# EAGLE design LAUNCHXL-F28069_B_1400922 (EAGLE 8.4.1)

## Sheet 1 of 2
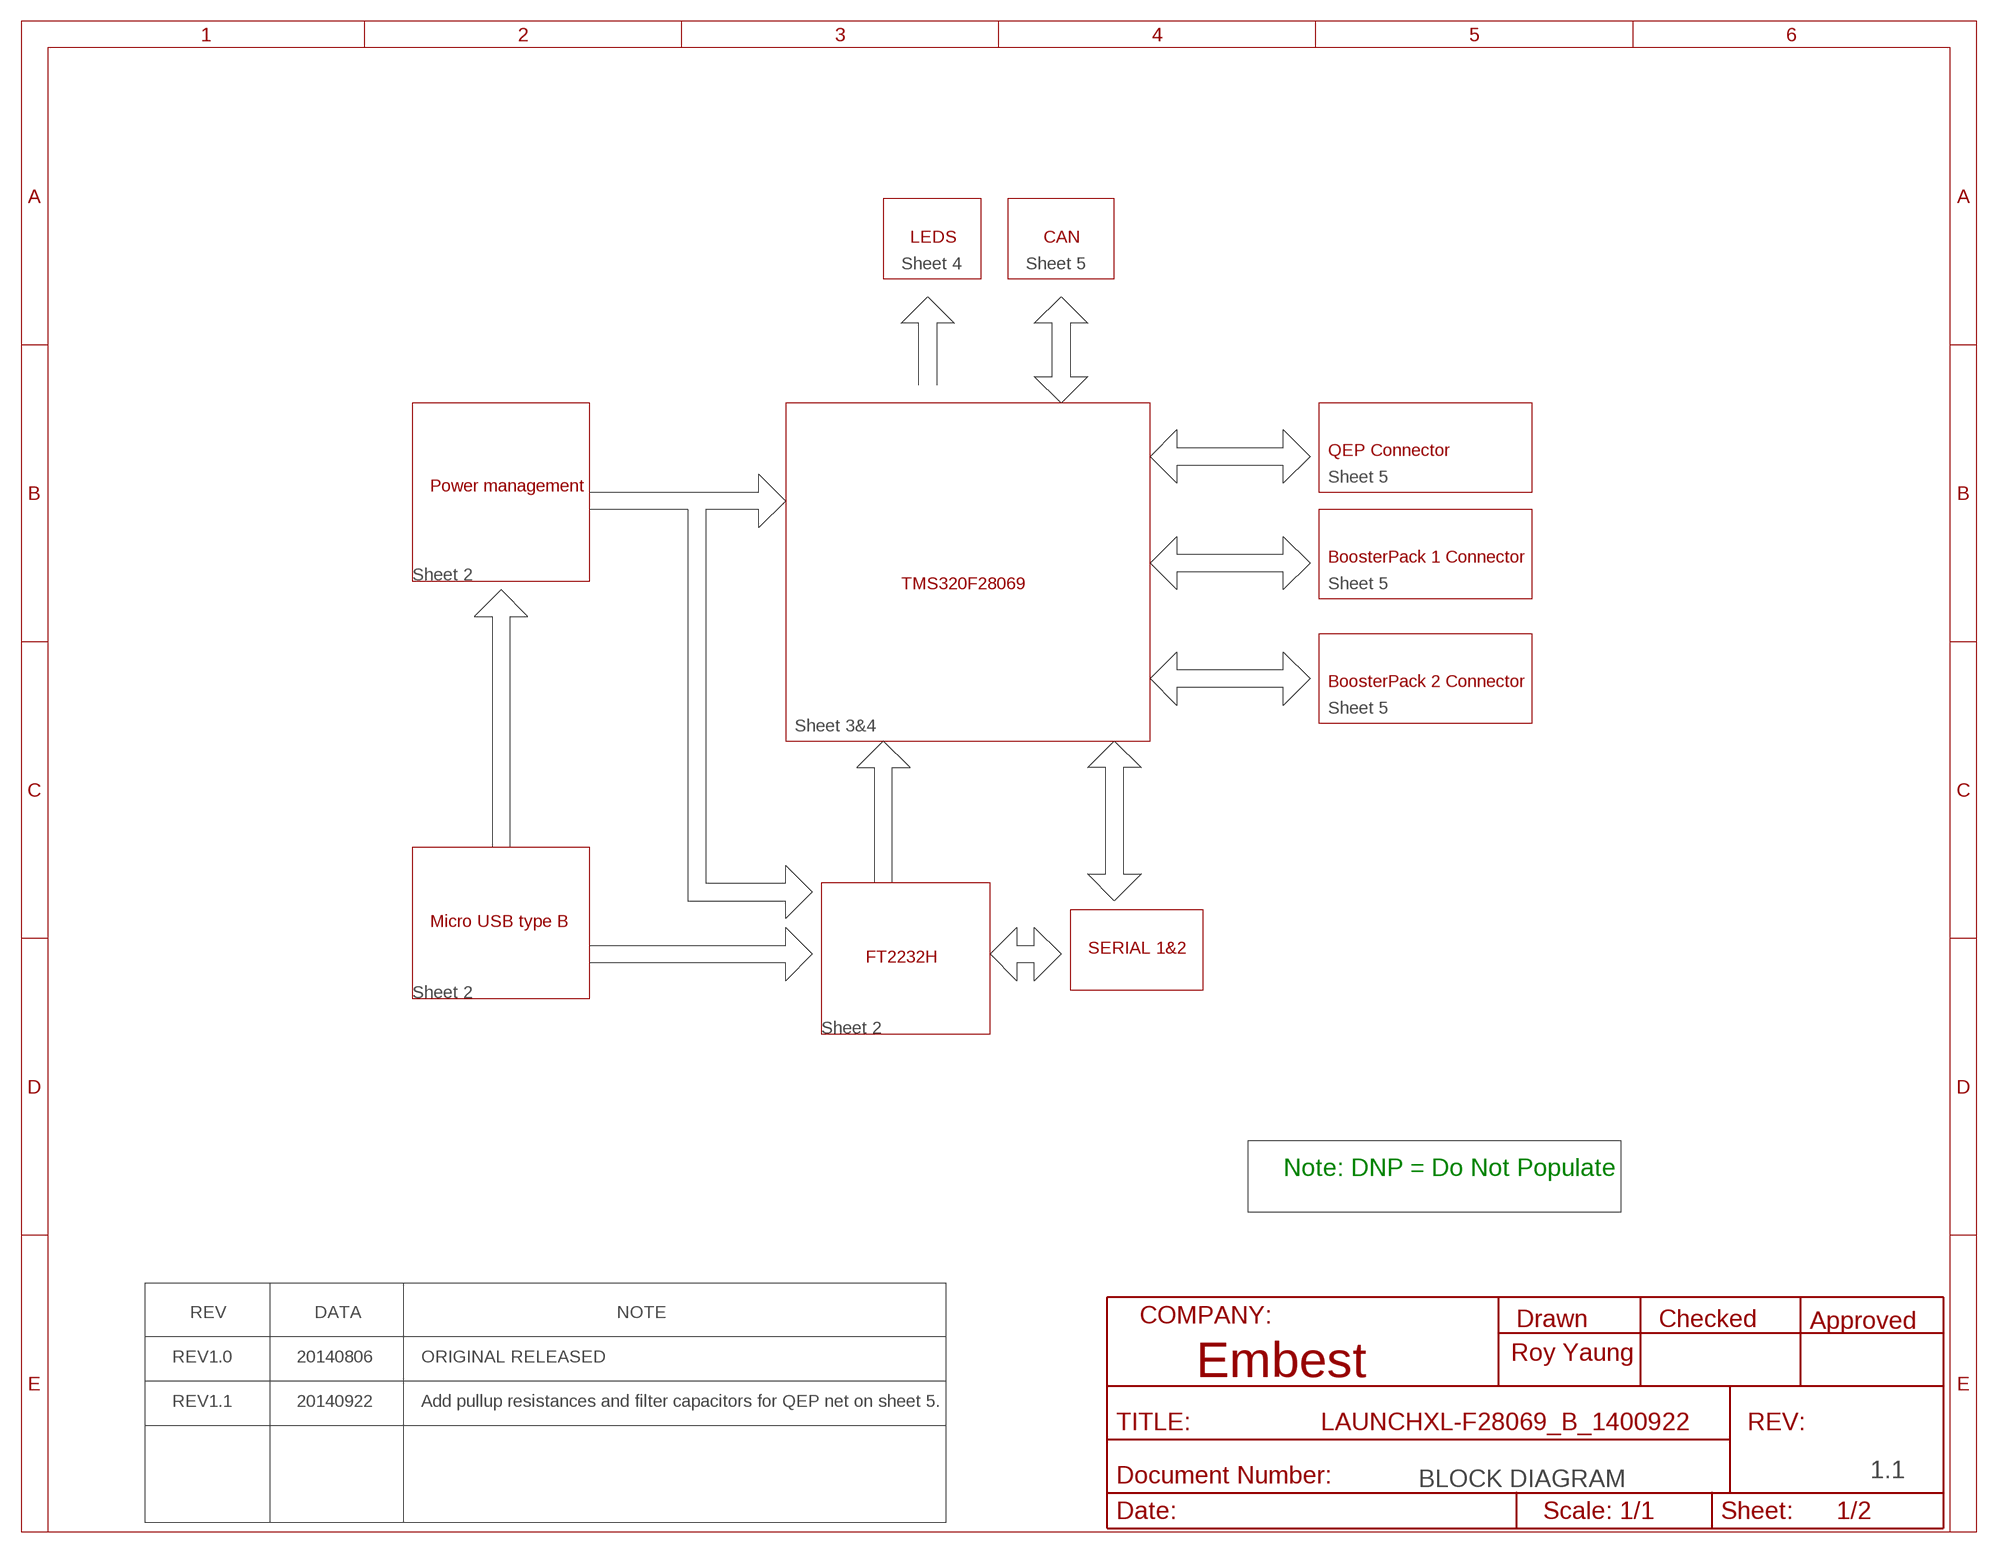
[diagram p0: schematic, sheet 1]

### Notes on the sheet
- LEDS | CAN
- Sheet 4 | Sheet 5
- QEP Connector
- Sheet 5
- Power management
- BoosterPack 1 Connector
- Sheet 2
- TMS320F28069 | Sheet 5
- BoosterPack 2 Connector
- Sheet 5
- Sheet 3&4
- Micro USB type B
- SERIAL 1&2
- FT2232H
- Sheet 2
- Sheet 2
- Note: DNP = Do Not Populate
- REV | DATA | NOTE
- REV1.0 | 20140806 | ORIGINAL RELEASED | Roy Yaung
- REV1.1 | 20140922 | Add pullup resistances and filter capacitors for QEP net on sheet 5.
- 1.1
- BLOCK DIAGRAM

## Sheet 2 of 2
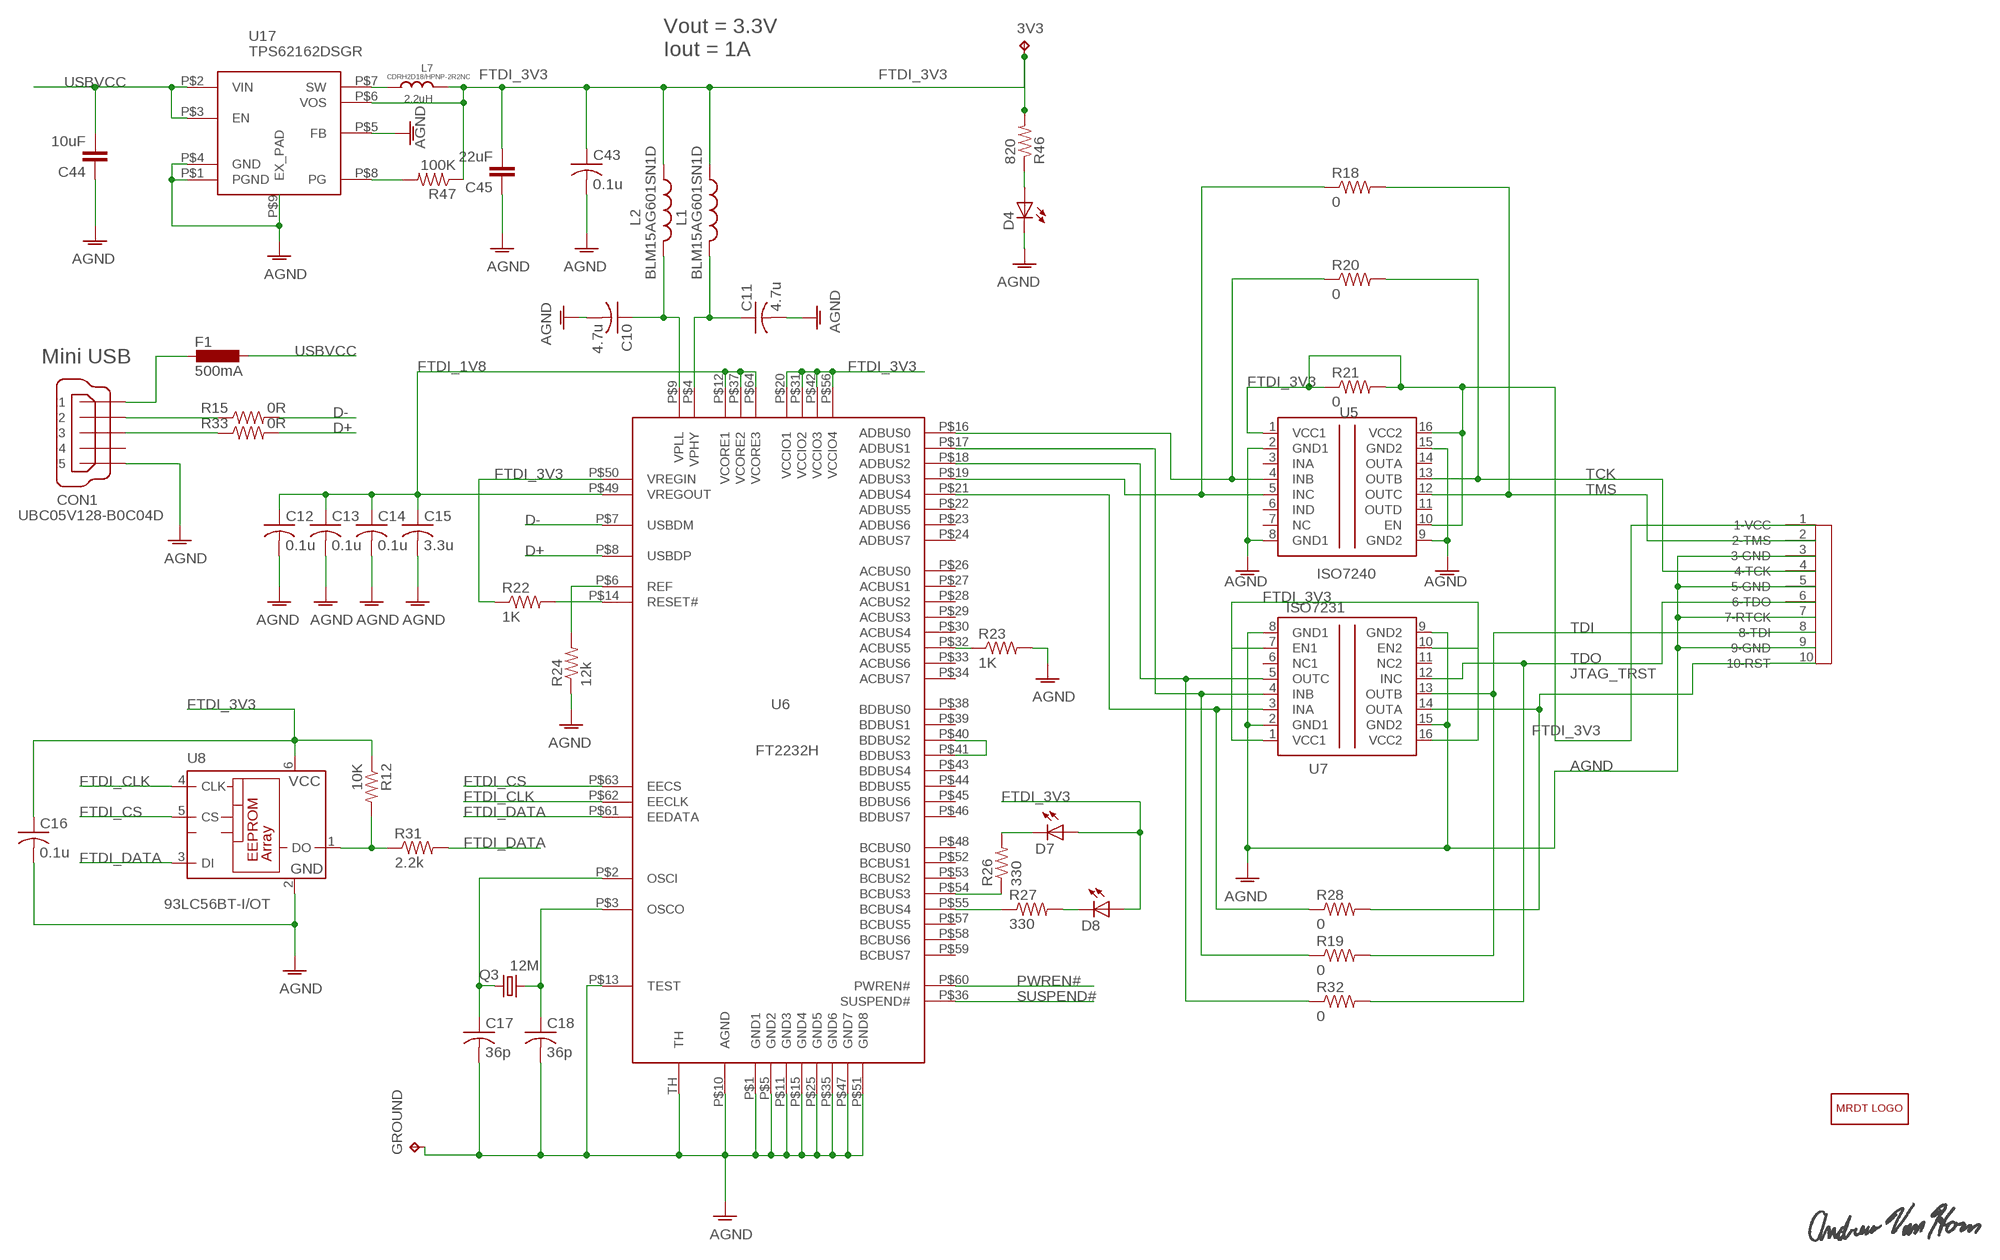
[diagram p1: schematic, sheet 2]

### Parts
3V3  TESTPAD_TPB1,27  [TESTPAD_B1,27]
C10  4.7u  C-USC0402  [C0402]
C11  4.7u  C-USC0402  [C0402]
C12  0.1u  C-USC0402  [C0402]
C13  0.1u  C-USC0402  [C0402]
C14  0.1u  C-USC0402  [C0402]
C15  3.3u  C-USC0402  [C0402]
C16  0.1u  C-USC0402  [C0402]
C17  36p  C-USC0402  [C0402]
C18  36p  C-USC0402  [C0402]
C43  0.1u  C-USC0402  [C0402]
C44  10uF  SPARKFUN_CAP1210  [SPARKFUN_1210]
C45  22uF  SPARKFUN_CAP1210  [SPARKFUN_1210]
CON1  UBC05V128-B0C04D  MINI-USB-32005-201  [32005-201]
D4  LEDCHIP-LED0603  [CHIP-LED0603]
D7  LEDCHIP-LED0603  [CHIP-LED0603]
D8  LEDCHIP-LED0603  [CHIP-LED0603]
F1  500mA  L-EUL1812  [L1812]
GROUND  TESTPAD_TPB1,27  [TESTPAD_B1,27]
L1  BLM15AG601SN1D  L-US0402  [R0402]
L2  BLM15AG601SN1D  L-US0402  [R0402]
L7  2.2uH  VLF4012A`  [INDUCT-3.2*3.2]
LOGO1  MRDT_LOGO  [MRDT_LOGO]
Q3  12M  CRYSTALHC49UP  [HC49UP]
R12  10K  R-US_R0402  [R0402]
R15  0R  R-US_R0402  [R0402]
R18  0  R-US_R1206  [R1206]
R19  0  R-US_R1206  [R1206]
R20  0  R-US_R1206  [R1206]
R21  0  R-US_R1206  [R1206]
R22  1K  R-US_R0402  [R0402]
R23  1K  R-US_R0402  [R0402]
R24  12k  R-US_R0402  [R0402]
R26  330  R-US_R0402  [R0402]
R27  330  R-US_R0402  [R0402]
R28  0  R-US_R1206  [R1206]
R31  2.2k  R-US_R0402  [R0402]
R32  0  R-US_R1206  [R1206]
R33  0R  R-US_R0402  [R0402]
R46  820  R-US_R0402  [R0402]
R47  100K  R-US_R0402  [R0402]
U5  ISO7240  [SO-16DW]
U6  FT2232H  [QFN64]
U7  ISO7231  [SO-16DW]
U8  93LC56BT-I/OT  93  [SOT23-6]
U17  TPS62162DSGR  [TI_DSG8]
U$1  1175-1733-ND  [1.27MM_2X5_BOX_HEADER_STRAIGHT]
U$2  ANDREW_VAN_HORN_SIGNATURE  [ANDREW_VAN_HORN_SIGNATURE]

### Nets
AGND: C10.2 C11.2 C12.2 C13.2 C14.2 C15.2 C16.2 C17.2 C18.2 C43.2 C44.1 C45.1 CON1.5 D4.C GROUND.TP R23.2 R24.1 U5.2(GND1) U5.8(GND1) U5.9(GND2) U5.15(GND2) U6.P$1(GND1) U6.P$5(GND2) U6.P$10(AGND) U6.P$11(GND3) U6.P$13(TEST) U6.P$15(GND4) U6.P$25(GND5) U6.P$35(GND6) U6.P$47(GND7) U6.P$51(GND8) U6.TH U7.2(GND1) U7.8(GND1) U7.9(GND2) U7.15(GND2) U8.2(GND) U17.P$1(PGND) U17.P$4(GND) U17.P$5(FB) U17.P$9(EX_PAD) U$1.3(3-GND) U$1.5(5-GND) U$1.7(7-RTCK) U$1.9(9-GND)
D+: R33.2 U6.P$8(USBDP)
D-: R15.2 U6.P$7(USBDM)
FTDI_1V8: C12.1 C13.1 C14.1 C15.1 U6.P$12(VCORE1) U6.P$37(VCORE2) U6.P$49(VREGOUT) U6.P$64(VCORE3)
FTDI_3V3: 3V3.TP C16.1 C43.1 C45.2 D7.A D8.A L1.1 L2.1 L7.P$1 R12.1 R21.1 R21.2 R22.1 R46.2 R47.1 U5.1(VCC1) U5.10(EN) U5.16(VCC2) U6.P$20(VCCIO1) U6.P$31(VCCIO2) U6.P$42(VCCIO3) U6.P$50(VREGIN) U6.P$56(VCCIO4) U7.1(VCC1) U7.7(EN1) U7.10(EN2) U7.16(VCC2) U8.6(VCC) U17.P$6(VOS) U$1.1(1-VCC)
FTDI_CLK: U6.P$62(EECLK) U8.4(CLK)
FTDI_CS: U6.P$63(EECS) U8.5(CS)
FTDI_DATA: R31.2 U6.P$61(EEDATA) U8.3(DI)
JTAG_TRST: R28.2 U7.14(OUTA) U$1.10(10-RST)
N$1: R20.1 U5.4(INB) U6.P$16(ADBUS0)
N$2: C17.1 Q3.1 U6.P$2(OSCI)
N$4: R19.1 U6.P$17(ADBUS1) U7.4(INB)
N$5: R32.1 U6.P$18(ADBUS2) U7.5(OUTC)
N$6: R18.1 U5.5(INC) U6.P$19(ADBUS3)
N$7: C18.1 Q3.2 U6.P$3(OSCO)
N$12: R12.2 R31.1 U8.1(DO)
N$13: R28.1 U6.P$21(ADBUS4) U7.3(INA)
N$14: R23.1 U6.P$32(ACBUS5)
N$15: U6.P$40(BDBUS2) U6.P$41(BDBUS3)
N$17: R24.2 U6.P$6(REF)
N$19: R26.1 U6.P$54(BCBUS3)
N$20: C11.1 L1.2 U6.P$4(VPHY)
N$22: R27.1 U6.P$55(BCBUS4)
N$23: D7.C R26.2
N$24: D8.C R27.2
N$26: C10.1 L2.2 U6.P$9(VPLL)
N$34: R22.2 U6.P$14(RESET#)
N$38: CON1.2 R15.1
N$39: CON1.3 R33.1
N$40: D4.A R46.1
N$43: R47.2 U17.P$8(PG)
N$51: L7.P$2 U17.P$7(SW)
PWREN#: U6.P$60(PWREN#)
SUSPEND#: U6.P$36(SUSPEND#)
TCK: R20.2 U5.13(OUTB) U$1.4(4-TCK)
TDI: R19.2 U7.13(OUTB) U$1.8(8-TDI)
TDO: R32.2 U7.12(INC) U$1.6(6-TDO)
TMS: R18.2 U5.12(OUTC) U$1.2(2-TMS)
USBVCC: C44.2 F1.1 U17.P$2(VIN) U17.P$3(EN)
XUSB: CON1.1 F1.2
Unconnected: CON1.4 U5.3(INA) U5.6(IND) U5.7(NC) U5.11(OUTD) U5.14(OUTA) U6.P$22(ADBUS5) U6.P$23(ADBUS6) U6.P$24(ADBUS7) U6.P$26(ACBUS0) U6.P$27(ACBUS1) U6.P$28(ACBUS2) U6.P$29(ACBUS3) U6.P$30(ACBUS4) U6.P$33(ACBUS6) U6.P$34(ACBUS7) U6.P$38(BDBUS0) U6.P$39(BDBUS1) U6.P$43(BDBUS4) U6.P$44(BDBUS5) U6.P$45(BDBUS6) U6.P$46(BDBUS7) U6.P$48(BCBUS0) U6.P$52(BCBUS1) U6.P$53(BCBUS2) U6.P$57(BCBUS5) U6.P$58(BCBUS6) U6.P$59(BCBUS7) U7.6(NC1) U7.11(NC2)

### Notes on the sheet
- Vout = 3.3V
- Iout = 1A
- CDRH2D18/HPNP-2R2NC
- Mini USB

## Library data of the parts
3V3 GROUND = RF430FRL152H_EVM_a:TESTPAD_TP: Test pad
C10-C18 C43 = rcl:C-US: CAPACITOR, American symbol
C44 C45 = RF430FRL152H_EVM_a:SPARKFUN_CAP: Capacitor Standard 0603 ceramic capacitor, and 0.1" leaded capacitor.
CON1 = con-cypressindustries:MINI-USB-: MINI USB-B Conector Source: www.cypressindustries.com; OC_FARNELL: unknown; OC_NEWARK: unknown
D4 D7 D8 = led:LED: LED OSRAM: - CHIPLED LG R971, LG N971, LY N971, LG Q971, LY Q971, LO R971, LY R971 LH N974, LH R974 LS Q976, LO Q976, LY Q976 LO Q996 - Hyper CHIPLED LW Q18S LB Q993, LB Q99A, LB R99A - SideLED LS A670, LO A670, LY A670, LG A670, LP A670 LB A673, LV A673, LT A673, LW A673 LH A674 LY A675 LS A676, LA A676, LO A676, LY A676, LW A676 LS A679, LY A679, LG A679 - Hyper Micro SIDELED® LS Y876, LA Y876, LO Y876, LY Y876 LT Y87S - SmartLED LW L88C, LW L88S LB L89C, LB L89S, LG L890 LS L89K, LO L89K, LY L89K LS L896, LA L896, LO L896, LY L896 - TOPLED LS T670, LO T670, LY T670, LG T670, LP T670 LSG T670, LSP T670, LSY T670, LOP T670, LYG T670 LG T671, LOG T671, LSG T671 LB T673, LV T673, LT T673, LW T673 LH T674 LS T676, LA T676, LO T676, LY T676, LB T676, LH T676, LSB T676, LW T676 LB T67C, LV T67C, LT T67C, LS T67K, LO T67K, LY T67K, LW E67C LS E67B, LA E67B, LO E67B, LY E67B, LB E67C, LV E67C, LT E67C LW T67C LS T679, LY T679, LG T679 LS T770, LO T770, LY T770, LG T770, LP T770 LB T773, LV T773, LT T773, LW T773 LH T774 LS E675, LA E675, LY E675, LS T675 LS T776, LA T776, LO T776, LY T776, LB T776 LHGB T686 LT T68C, LB T68C - Hyper Mini TOPLED® LB M676 - Mini TOPLED Santana® LG M470 LS M47K, LO M47K, LY M47K Source: http://www.osram.convergy.de LUXEON: - LUMILED® LXK2-PW12-R00, LXK2-PW12-S00, LXK2-PW14-U00, LXK2-PW14-V00 LXK2-PM12-R00, LXK2-PM12-S00, LXK2-PM14-U00 LXK2-PE12-Q00, LXK2-PE12-R00, LXK2-PE12-S00, LXK2-PE14-T00, LXK2-PE14-U00 LXK2-PB12-K00, LXK2-PB12-L00, LXK2-PB12-M00, LXK2-PB14-N00, LXK2-PB14-P00, LXK2-PB14-Q00 LXK2-PR12-L00, LXK2-PR12-M00, LXK2-PR14-Q00, LXK2-PR14-R00 LXK2-PD12-Q00, LXK2-PD12-R00, LXK2-PD12-S00 LXK2-PH12-R00, LXK2-PH12-S00 LXK2-PL12-P00, LXK2-PL12-Q00, LXK2-PL12-R00 Source: www.luxeon.com KINGBRIGHT: KA-3528ASYC Source: www.kingbright.com
F1 = rcl:L-EU: INDUCTOR, European symbol
L1 L2 = rcl:L-US: INDUCTOR, American symbol
L7 = LAUNCHXL-F28027:VLF4012A
LOGO1 = MRDT-Hardware:MRDT_LOGO
Q3 = crystal:CRYSTAL: CRYSTAL; OC_FARNELL: unknown; OC_NEWARK: unknown
R12 R15 R18-R24 R26-R28 R31-R33 R46 R47 = rcl:R-US_: RESISTOR, American symbol
U5 = texas:ISO7240: HIGH SPEED QUAD DIGITAL ISOLATORS Source: http://focus.ti.com/lit/ds/symlink/iso7240m.pdf; MPN: ISO7240MDW; OC_FARNELL: 1755124; OC_NEWARK: 58M0385
U6 = ti_trey:FT2232H
U7 = texas:ISO7231
U8 = ti_trey:93*: Serial EPROM 1 K/2 K/4 K, low voltage, Microwire
U17 = LAUNCHXL-F28027:TPS62162DSGR
U$1 = MRDT-Connectors:1175-1733-ND
U$2 = MRDT-Signatures:ANDREW_VAN_HORN_SIGNATURE

## Net classes
0 default: width 0.152 mm, drill 0.305 mm, clearance 0.152 mm

## Board
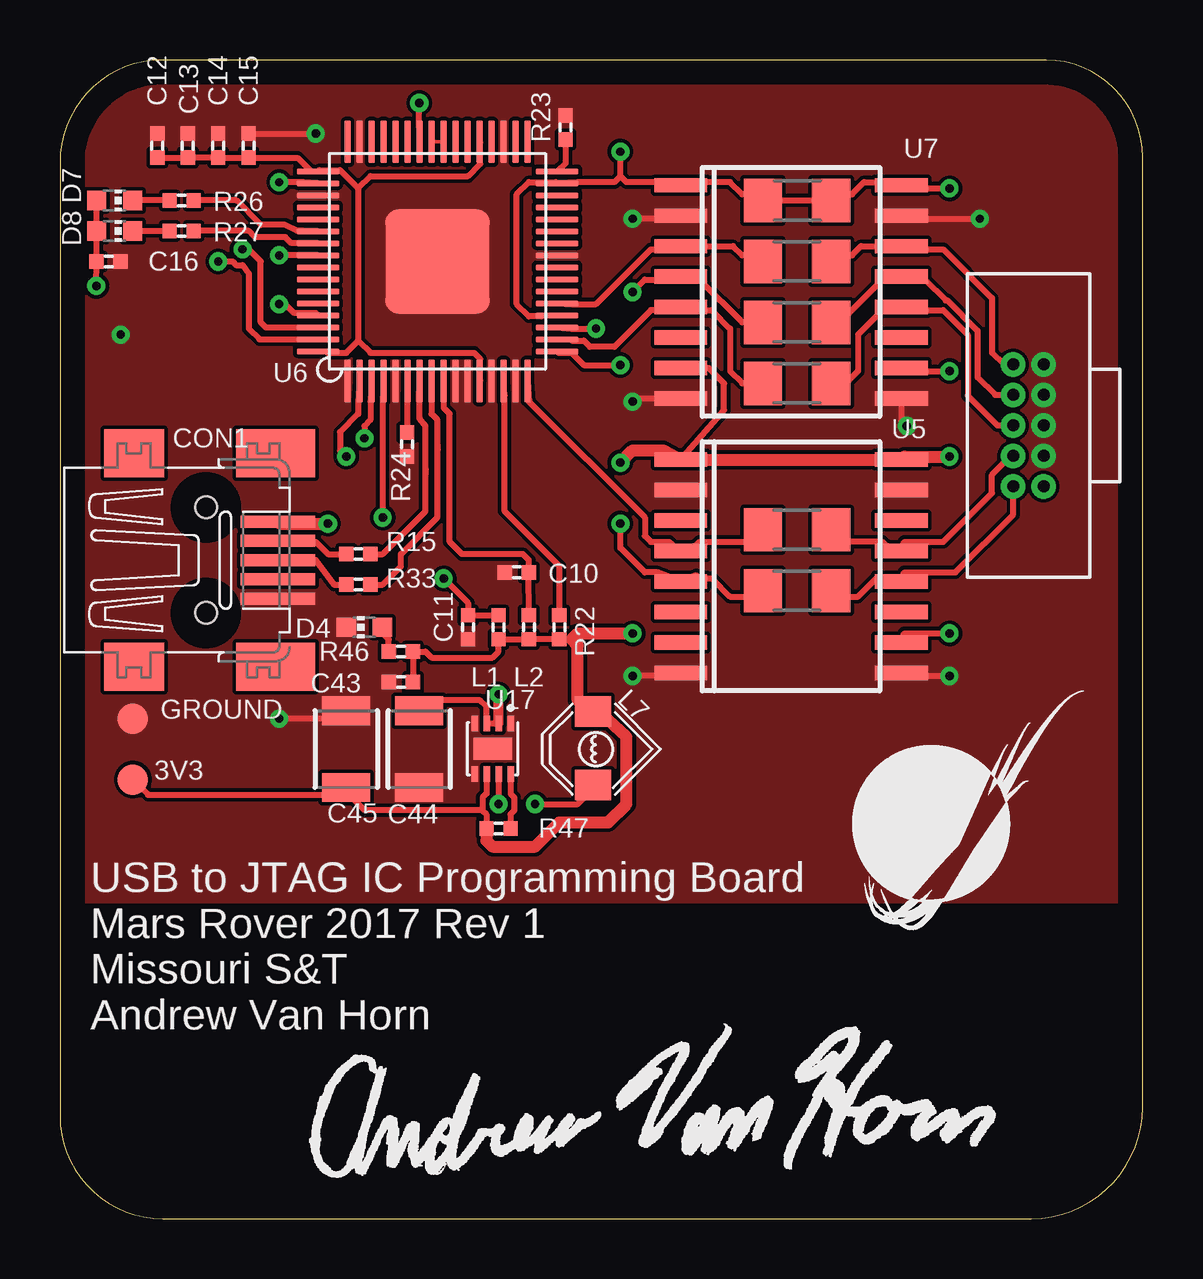
[diagram p2: board, top side]
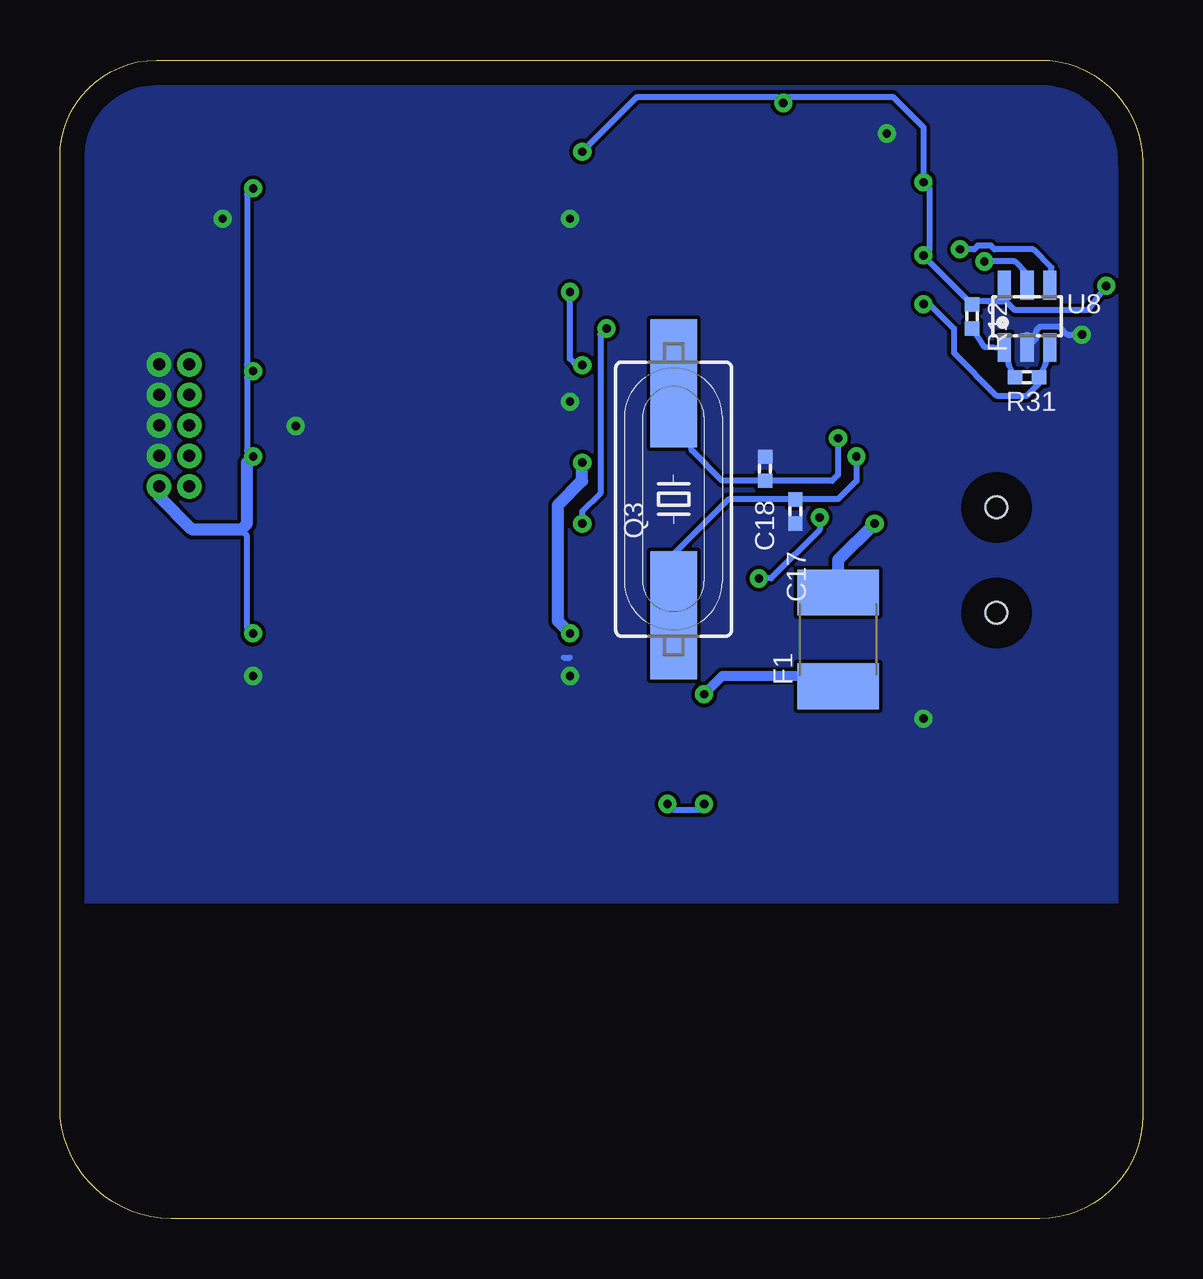
[diagram p3: board, bottom side, seen from below]

Size 45.13 x 48.27 mm. Coordinates in mm from the lower left corner, seen from the top.
Outline: 0,43.99 0,4.29 arc90 4.29,0 40.49,0 arc90 45.13,4.64 45.13,44.23 arc90 41.11,48.27 4.27,48.27 arc90 0,43.99
Copper layers (1*16): Top 0.035mm / dielectric 1.5mm / Bottom 0.035mm
Design rules "default": minimum track width 6mil, minimum drill 0.35mm, track to track 6mil, track to pad 6mil, pad to pad 6mil, via to via 6mil, smd to smd 6mil, copper to edge 40mil, drill to drill 6mil, minimum pad ring 10mil, minimum via ring 8mil, stop-mask expansion 4mil, vias tented up to drill 0mil, thermal gap 10mil

### Footprints (pad centres in the part's own frame; a part is rotated, then mirrored left to right if it is on the bottom)
TESTPAD_B1,27 = smd 1.27 x 1.27: TP 0,0
C0402 = smd 0.6 x 0.6: 1 -0.5,0; 2 0.5,0
SPARKFUN_1210 = smd 1.2 x 2: 1 -1.6,0; 2 1.6,0
32005-201 = smd 3.1 x 0.5: 1 3,1.6; 2 3,0.8; 3 3,0; 4 3,-0.8; 5 3,-1.6 | smd 2.5 x 2: M1 -3,-4.45; M2 -3,4.45 | smd 3.3 x 2: M3 2.9,4.45; M4 2.9,-4.45 | hole 0.9: 0,2.2; 0,-2.2
CHIP-LED0603 = smd 0.8 x 0.8: A 0,-0.75; C 0,0.75
L1812 = smd 1.9 x 3.4: 1 -1.95,0; 2 1.95,0
R0402 = smd 0.6 x 0.6: 1 -0.5,0; 2 0.5,0
INDUCT-3.2*3.2 = smd 1.5 x 1.27 rotated 135: P$1 1.019,1.189 | smd 1.5 x 1.27 rotated 315: P$2 -1.137,-0.966
HC49UP = smd 5.334 x 1.93: 1 -4.826,0; 2 4.826,0
R1206 = smd 1.6 x 1.803: 1 -1.422,0; 2 1.422,0
SO-16DW = smd 0.6 x 2.2: 1 -4.445,-4.6; 2 -3.175,-4.6; 3 -1.905,-4.6; 4 -0.635,-4.6; 5 0.635,-4.6; 6 1.905,-4.6; 7 3.175,-4.6; 8 4.445,-4.6; 9 4.445,4.6; 10 3.175,4.6; 11 1.905,4.6; 12 0.635,4.6; 13 -0.635,4.6; 14 -1.905,4.6; 15 -3.175,4.6; 16 -4.445,4.6
QFN64 = smd 1.778 x 0.254: P$1 -4.983,3.75; P$2 -4.983,3.25; P$3 -4.983,2.75; P$4 -4.983,2.25; P$5 -4.983,1.75; P$6 -4.983,1.25; P$7 -4.983,0.75; P$8 -4.983,0.25; P$9 -4.983,-0.25; P$10 -4.983,-0.75; P$11 -4.983,-1.25; P$12 -4.983,-1.75; P$13 -4.983,-2.25; P$14 -4.983,-2.75; P$15 -4.983,-3.25; P$16 -4.983,-3.75; P$33 4.983,-3.75; P$34 4.983,-3.25; P$35 4.983,-2.75; P$36 4.983,-2.25; P$37 4.983,-1.75; P$38 4.983,-1.25; P$39 4.983,-0.75; P$40 4.983,-0.25; P$41 4.983,0.25; P$42 4.983,0.75; P$43 4.983,1.25; P$44 4.983,1.75; P$45 4.983,2.25; P$46 4.983,2.75; P$47 4.983,3.25; P$48 4.983,3.75 | smd 0.254 x 1.778: P$17 -3.75,-4.983; P$18 -3.25,-4.983; P$19 -2.75,-4.983; P$20 -2.25,-4.983; P$21 -1.75,-4.983; P$22 -1.25,-4.983; P$23 -0.75,-4.983; P$24 -0.25,-4.983; P$25 0.25,-4.983; P$26 0.75,-4.983; P$27 1.25,-4.983; P$28 1.75,-4.983; P$29 2.25,-4.983; P$30 2.75,-4.983; P$31 3.25,-4.983; P$32 3.75,-4.983; P$49 3.75,4.983; P$50 3.25,4.983; P$51 2.75,4.983; P$52 2.25,4.983; P$53 1.75,4.983; P$54 1.25,4.983; P$55 0.75,4.983; P$56 0.25,4.983; P$57 -0.25,4.983; P$58 -0.75,4.983; P$59 -1.25,4.983; P$60 -1.75,4.983; P$61 -2.25,4.983; P$62 -2.75,4.983; P$63 -3.25,4.983; P$64 -3.75,4.983 | smd 4.35 x 4.35: TH 0,0
SOT23-6 = smd 0.55 x 1.2: 1 -0.95,-1.3; 2 0,-1.3; 3 0.95,-1.3; 4 0.95,1.3; 5 0,1.3; 6 -0.95,1.3
TI_DSG8 = smd 0.27 x 0.635: P$1 0,-0.05; P$2 0.5,-0.05; P$3 1,-0.05; P$4 1.5,-0.05; P$5 1.5,2.05; P$6 1,2.05; P$7 0.5,2.05; P$8 0,2.05 | smd 1.6 x 0.9: P$9 0.75,1
1.27MM_2X5_BOX_HEADER_STRAIGHT = drill 0.5: 1 1.915,8.865; 2 3.185,8.865; 3 1.915,7.595; 4 3.185,7.595; 5 1.915,6.325; 6 3.185,6.325; 7 1.915,5.055; 8 3.185,5.055; 9 1.915,3.785; 10 3.185,3.785

### Placement (x,y rotation side)
3V3  3.04,18.29 0 top
C10  19.04,26.92 180 top
C11  17.01,24.64 270 top
C12  4.06,44.7 90 top
C13  5.33,44.7 90 top
C14  6.6,44.7 90 top
C15  7.87,44.7 90 top
C16  2.02,39.88 0 top
C17  14.47,29.46 270 bottom
C18  15.74,31.24 90 bottom
C43  14.22,22.35 180 top
C44  14.98,19.56 90 top
C45  11.93,19.56 270 top
CON1  6.09,27.43 0 top
D4  12.69,24.64 90 top
D7  2.28,42.42 270 top
D8  2.28,41.15 270 top
F1  12.69,24.13 90 bottom
GROUND  3.04,20.83 0 top
L1  18.28,24.64 90 top
L2  19.55,24.64 90 top
L7  22.34,19.56 45 top
LOGO1  33.01,11.18 0 top
Q3  19.55,29.97 90 bottom
R12  7.1,37.59 270 bottom
R15  12.44,27.69 0 top
R18  30.73,26.16 0 top
R19  30.73,37.34 0 top
R20  30.73,28.7 0 top
R21  30.73,42.42 180 top
R22  20.82,24.64 90 top
R23  21.07,45.47 90 top
R24  14.47,32.26 90 top
R26  5.07,42.42 180 top
R27  5.07,41.15 180 top
R28  30.73,39.88 0 top
R31  4.82,35.05 0 bottom
R32  30.73,34.8 0 top
R33  12.44,26.42 0 top
R46  14.22,23.62 0 top
R47  18.28,16.26 0 top
U5  30.47,27.18 270 top
U6  15.74,39.88 90 top
U7  30.47,38.61 270 top
U8  4.82,37.59 0 bottom
U17  18.79,20.57 180 top
U$1  42.92,39.37 180 top
U$2  9.14,0.76 0 top

### Tracks (layer width: path | path; a pad name or v marks a point on that pad's centre or on a via)
AGND  (via drill 0.35)
  Top 0.254: D4.C 11.93,24.63 | C15.2 v10.65,45.2 v10.66,45.21 | U7.8 23.99,34.16 v23.87,34.04 | U7.2 25.74,41.66 v23.87,41.66 | U7.15 35.2,41.66 v38.35,41.66 | U7.9 35.07,33.25 v35.3,33.02 | U5.9 35.2,22.61 v37.08,22.61 | U5.8 25.74,22.61 v23.87,22.61 | C45.1 11.6,20.83 v9.14,20.83
  Bottom 0.254: 4.82,36.83 U8.2 4.42,36.69 4.42,37.01 4.26,37.17 3.48,37.17 3.14,36.83 v2.53,36.83 | 24.12,23.37 23.87,23.37
  pour Top (no thermals): 1.01,47.75 44.44,47.75 44.44,13.21 0.25,13.21 0.25,46.74
  pour Bottom (no thermals): 0.75,47.5 44.7,47.5 44.7,14.99 44.95,13.21 0.5,13.21 0.5,46.99 0.75,47.24
D+
  Top 0.254: R33.2 13.45,26.42 14.22,27.18 14.22,27.69 15.74,29.21 15.74,32.26 | U6.P$8 15.49,34.04 15.49,33.53 15.74,33.27 15.74,32.26 | 15.74,32.26 15.74,32
D-
  Top 0.254: R15.2 13.45,27.69 15.23,29.46 15.23,31.24 | 14.98,34.04 U6.P$7 14.98,33.34 15.23,33.02 15.23,31.24 | 15.23,31.24 15.23,30.99
FTDI_1V8
  Top 0.152: U6.P$12 17.52,34.92 | U6.P$64 11.11,36.13 11.17,36.07
  Top 0.254: C12.1 C13.1 C14.1 C15.1 7.87,44.2 9.9,44.2 10.47,43.63 U6.P$49 10.82,43.69 11.68,43.69 12.44,42.93 | 17.52,34.92 17.52,35.81 17.26,36.07 12.95,36.07 12.44,36.58 | U6.P$37 17.52,44.83 17.52,43.94 17.01,43.43 12.95,43.43 12.44,42.93 | 11.17,36.07 11.93,36.07 12.44,36.58 | 12.44,42.93 12.44,36.58
FTDI_3V3  (via drill 0.35)
  Top 0.152: U6.P$42 14.99,45.45 14.98,45.47 | U6.P$20 20.09,37.63 20.06,37.59 | v9.14,40.13
  Top 0.254: D7.A D8.A C16.1 v1.52,38.86 | 17.78,18.52 U17.P$6 17.79,17.71 17.62,17.54 17.62,17 | 17.62,17 17.78,16.84 R47.1 | 17.62,17 17.6,17.02 12.69,17.02 12.06,17.65 | 12.06,17.65 11.93,17.78 C45.2 | 3V3.TP 3.67,17.65 12.06,17.65 | 14.72,23.63 R46.2 | 22.34,21.24 L7.P$1 21.58,21.59 | 14.98,45.47 v14.98,46.48 | 20.06,37.59 19.55,37.59 19.04,38.1 19.04,42.67 19.55,43.18 20.67,43.18 U6.P$31 21.58,43.18 23.11,43.18 23.36,43.43 | U6.P$56 v9.14,40.13 | 26.41,43.05 U7.1 25.39,43.18 23.61,43.18 23.36,43.43 | 26.41,43.05 26.53,43.05 | 26.41,43.05 26.53,43.18 27.93,43.18 28.44,42.67 29.05,42.67 R21.2 R21.1 32.25,42.42 32.5,42.67 33.01,42.67 33.52,43.18 34.94,43.18 U7.16 35.2,42.93 v37.08,42.93 | U5.10 35.2,24.38 v37.08,24.38 | 35.2,31.75 U5.16 | U7.10 35.2,35.31 v37.08,35.31 | U5.1 27.68,33.68 27.68,34.8 27.04,35.43 U7.7 | U6.P$50 10.15,43.18 v9.14,43.18 | 23.36,43.43 v23.36,44.45 | R46.2 C43.1 | R46.2 15.23,23.62 15.49,23.37 18.03,23.37 18.28,23.62 L1.1 L2.1 R22.1 21.33,24.13
  Top 0.508: R47.1 17.77,15.75 18.03,15.49 19.8,15.49 20.82,16.51 22.85,16.51 23.61,17.27 23.61,20.07 22.34,21.24 | 35.2,31.75 v37.08,31.75 | U5.16 U5.1 25.14,32 23.87,32 v23.36,31.5 | 21.58,21.59 21.58,23.88 21.33,24.13 21.58,24.38 v23.87,24.38
  Bottom 0.254: v1.52,38.86 2.28,37.85 5.33,37.85 5.71,38.23 | 7.23,38.22 v9.14,40.12 v9.14,40.13 8.88,40.39 8.88,42.93 v9.14,43.18 9.14,45.47 10.41,46.74 14.72,46.74 v14.98,46.48 15.23,46.74 21.07,46.74 v23.36,44.45 | 7.23,38.22 R12.1 | U8.6 5.77,38.29 5.71,38.23 | 6.47,38.23 6.34,38.23 | 6.34,38.23 5.71,38.23 | 6.34,38.23 6.35,38.22 7.23,38.22 | 37.33,31.5 v37.08,31.75 37.33,32 37.33,35.05 v37.08,35.31 37.33,35.56 37.33,42.67 v37.08,42.93 | v37.08,24.38 37.33,24.64 37.33,28.45 37.58,28.7
  Bottom 0.508: 37.33,31.5 37.33,28.96 37.58,28.7 39.62,28.7 41,30.09 U$1.1 | v23.87,24.38 24.38,24.89 24.38,29.72 23.36,30.73 v23.36,31.5
FTDI_CLK  (via drill 0.35)
  Top 0.254: v7.61,40.39 7.87,40.39 8.37,39.88 8.37,37.34 8.58,37.13 U6.P$62
  Bottom 0.254: U8.4 3.8,39.62 4.56,40.39 6.17,40.39 6.32,40.54 6.87,40.54 7.02,40.39 v7.61,40.39
FTDI_CS  (via drill 0.35)
  Top 0.254: v6.6,39.88 7.19,39.88 7.34,39.73 7.61,39.73 7.87,39.37 7.87,37.08 8.32,36.63 U6.P$63
  Bottom 0.254: U8.5 4.82,39.37 5.33,39.88 v6.6,39.88
FTDI_DATA  (via drill 0.35)
  Top 0.254: U6.P$61 10.66,37.72 9.77,37.72 9.39,38.1 v9.14,38.1
  Bottom 0.254: U8.3 4.06,35.56 R31.2 4.32,34.79 4.82,34.29 6.09,34.29 7.87,36.07 7.87,37.08 8.88,38.1 v9.14,38.1
JTAG_TRST
  Top 0.254: R28.2 32.4,40.13 33.01,40.13 33.39,40.51 U7.14 35.68,40.51 35.81,40.39 36.82,40.39 38.85,38.35 38.85,36.07 39.34,35.59 U$1.10
N$1
  Top 0.254: R20.1 28.8,28.19 26.66,28.19 26.53,28.07 U5.4 25.39,28.19 24.63,28.19 24.38,28.45 24.38,29.21 19.55,34.04 U6.P$16
N$2  (via drill 0.35)
  Top 0.254: U6.P$2 12.44,34.04 12.44,33.53 11.68,32.77 11.68,32 v11.93,31.75
  Bottom 0.254: v11.93,31.75 11.93,30.73 12.69,29.97 C17.1 17.27,29.96 19.55,27.69 Q3.1
N$4  (via drill 0.35)
  Top 0.254: R19.1 28.44,37.34 26.66,39.12 26,39.12 U7.4 25.39,39.12 24.38,39.12 v23.87,38.61 | U6.P$17 20.78,36.07 21.33,36.07 21.84,35.56 v23.36,35.56
  Bottom 0.254: v23.36,35.56 23.61,35.56 23.87,35.81 v23.87,38.61
N$5
  Top 0.254: U7.5 26.28,37.97 26.41,37.85 | U7.5 26.53,37.97 26.66,37.85 27.17,37.85 27.93,37.08 27.93,35.31 28.44,34.8 R32.1 | U6.P$18 21.28,36.63 21.33,36.58 21.84,36.58 22.09,36.32 23.11,36.32 24.63,37.85 25.14,37.85 U7.5
N$6  (via drill 0.35)
  Top 0.254: R18.1 29.05,25.91 27.93,25.91 27.17,26.67 26.66,26.67 26.53,26.8 U5.5 24.88,26.92 24.38,26.92 23.36,27.94 v23.36,28.96 | U6.P$19 21.33,37.08 v22.34,37.08
  Bottom 0.254: v22.34,37.08 22.6,36.83 22.6,30.23 23.36,29.46 v23.36,28.96
N$7  (via drill 0.35)
  Top 0.254: U6.P$3 12.95,34.04 12.95,33.27 12.69,33.02 v12.69,32.51
  Bottom 0.254: Q3.2 18.79,32 17.53,30.74 C18.1 12.95,30.73 12.69,30.99 v12.69,32.51
N$12
  Bottom 0.254: R12.2 6.6,36.32 U8.1 5.58,35.56 R31.1
N$13
  Top 0.254: R28.1 29.05,40.13 28.44,40.13 28.06,40.51 U7.3 25.39,40.39 24.63,40.39 22.34,38.1 21.33,38.1 U6.P$21
N$14
  Top 0.254: R23.1 21.07,43.98 U6.P$32
N$15
  Top 0.152: U6.P$41 U6.P$40
N$17
  Top 0.254: U6.P$6 14.47,34.04 R24.2
N$19
  Top 0.254: R26.1 7.36,42.42 8.37,41.4 9.39,41.4 9.9,41.15 10.15,41.15 U6.P$54
N$20  (via drill 0.35)
  Top 0.254: L1.2 C11.1 17.01,25.65 v15.99,26.67 | U6.P$4 13.45,34.04 v13.45,29.21
  Bottom 0.254: v13.45,29.21 13.45,28.7 15.49,26.67 v15.99,26.67
N$22
  Top 0.254: R27.1 7.87,41.15 8.12,40.89 9.39,40.89 9.64,40.64 10.15,40.64 U6.P$55
N$23
  Top 0.254: R26.2 D7.C
N$24
  Top 0.254: D8.C R27.2
N$26
  Top 0.254: 15.99,35.37 U6.P$9 15.99,34.04 15.99,33.78 16.25,33.53 16.25,28.19 16.76,27.69 19.3,27.69 19.55,27.43 C10.1 L2.2
N$34
  Top 0.254: R22.2 20.82,27.18 18.53,29.46 18.53,34.29 U6.P$14
N$38
  Top 0.254: CON1.2 10.66,28.19 11.17,27.69 R15.1
N$39
  Top 0.254: CON1.3 10.66,27.43 11.42,26.42 R33.1
N$40
  Top 0.254: R46.1 13.71,24.13 13.44,24.4 D4.A
N$43
  Top 0.254: R47.2 18.78,16.84 18.94,17 18.94,17.54 18.79,17.69 U17.P$8
N$51  (via drill 0.35)
  Top 0.254: U17.P$7 18.28,18.52 v18.28,17.27 | v19.8,17.27 21.58,17.27 22.22,17.91 L7.P$2
  Bottom 0.254: v18.28,17.27 18.53,17.02 19.55,17.02 v19.8,17.27
TCK
  Top 0.254: U5.13 34.41,28.07 34.28,28.19 32.66,28.19 R20.2 | U5.13 35.68,28.07 35.81,28.19 | U5.13 35.2,28.19 36.82,28.19 38.85,30.23 38.85,30.99 39.64,31.77 U$1.4
TDI
  Top 0.254: R19.2 32.4,37.59 32.76,37.59 34.41,39.24 U7.13 35.2,39.12 36.06,39.12 36.92,38.25 36.99,38.25 38.24,37 38.24,35.05 38.98,34.31 U$1.8
TDO
  Top 0.254: R32.2 32.76,34.8 33.27,35.31 33.27,36.83 34.28,37.85 34.94,37.85 U7.12 35.93,37.97 36.06,37.85 36.82,37.85 37.84,36.83 37.84,34.29 39.08,33.05 U$1.6
TMS
  Top 0.254: R18.2 32.5,26.16 32.76,25.91 33.27,25.91 34.03,26.67 34.94,26.67 U5.12 | U5.12 35.68,26.8 35.81,26.92 | U5.12 35.2,26.92 37.33,26.92 39.73,29.33 U$1.2
USBVCC  (via drill 0.35)
  Top 0.254: C44.2 15.05,21.16 15.49,21.59 17.52,21.59 17.77,21.34 17.77,20.71 17.78,20.71 17.78,20.63 U17.P$3 U17.P$2 18.28,20.63
  Top 0.406: 18.28,20.63 v18.28,21.84
  Bottom 0.254: 12.77,22.18 F1.1
  Bottom 0.406: 12.77,22.18 13.2,22.61 17.52,22.61 v18.28,21.84
XUSB  (via drill 0.35)
  Top 0.254: CON1.1 9.16,28.96
  Top 0.508: 9.16,28.96 v11.17,28.96
  Bottom 0.508: v11.17,28.96 12.69,27.43 F1.2

### Text on the board
tPlace: USB to JTAG IC Programming Board / Mars Rover 2017 Rev 1 / Missouri S&T / Andrew Van Horn